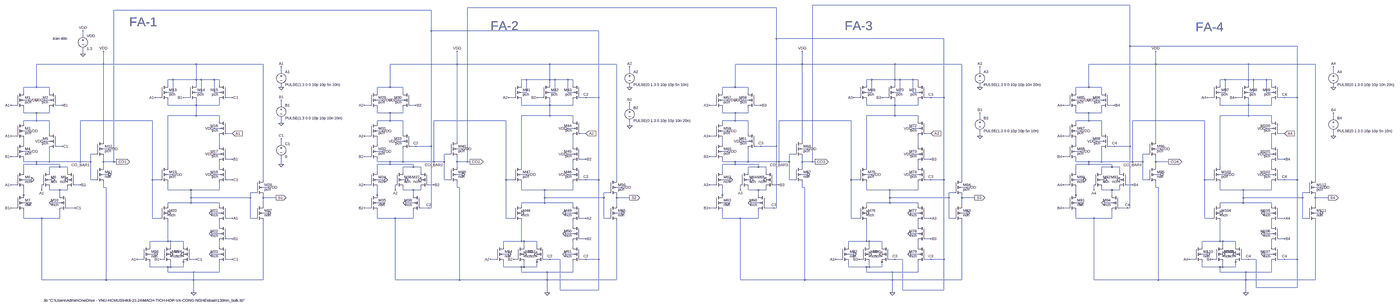
[diagram p0: schematic Full_adder_4bit.asc, whole sheet]
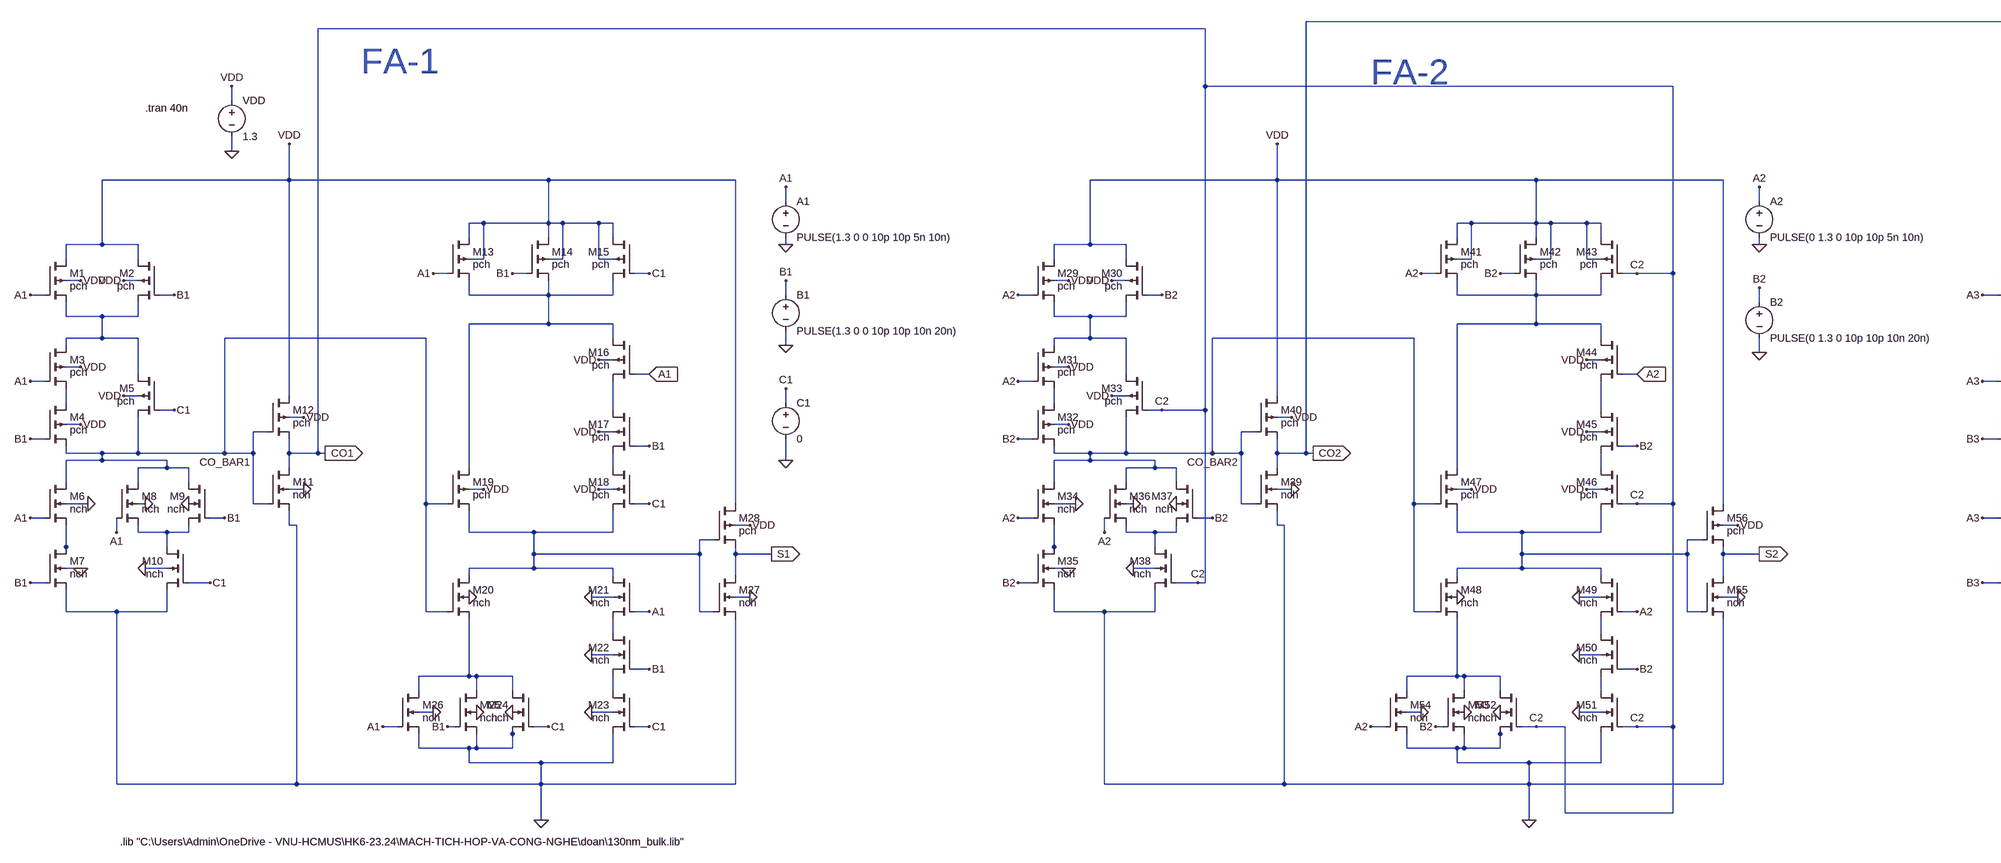
[diagram p1: schematic Full_adder_4bit.asc, part, row 1 of 1, column 1 of 2]
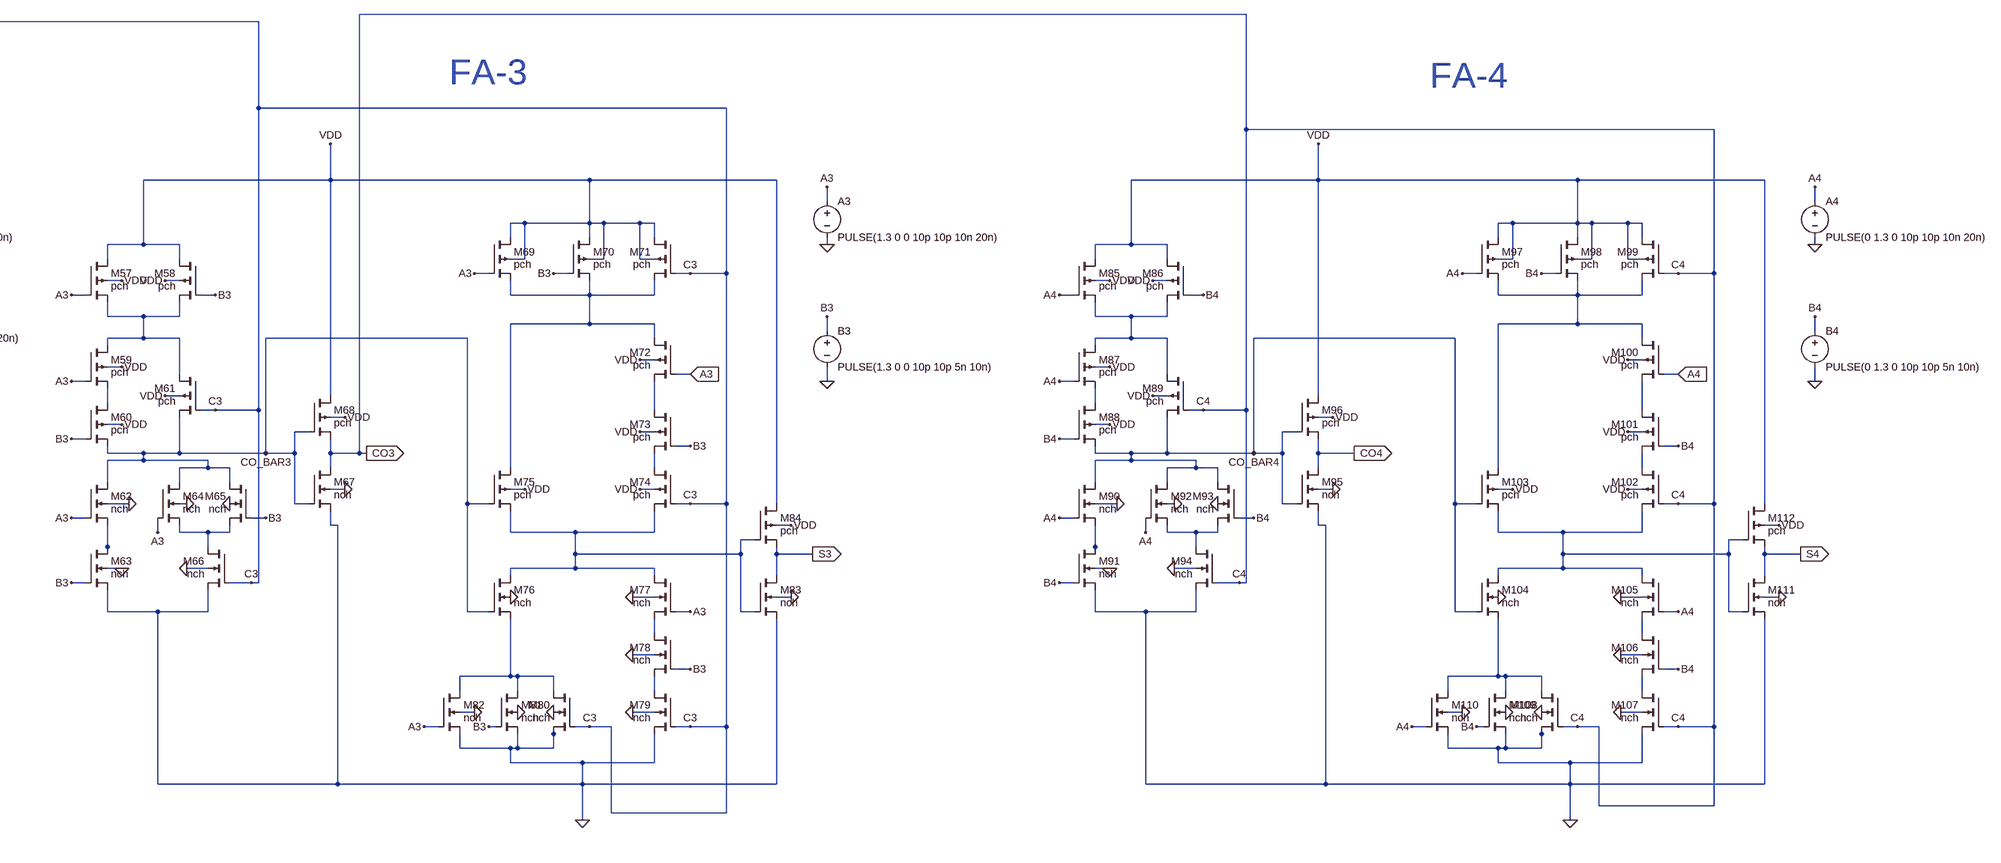
[diagram p2: schematic Full_adder_4bit.asc, part, row 1 of 1, column 2 of 2]
Full_adder_4bit.asc, the LTspice schematic file:
Version 4
SHEET 1 7908 1332
WIRE 6112 -928 4048 -928
WIRE 3824 -912 1904 -912
WIRE 1680 -896 -384 -896
WIRE 1680 -768 1680 -896
WIRE 2720 -768 1680 -768
WIRE -576 -736 -576 -768
WIRE 3824 -720 3824 -912
WIRE 4864 -720 3824 -720
WIRE 6112 -672 6112 -928
WIRE 7152 -672 6112 -672
WIRE -576 -624 -576 -656
WIRE -448 -560 -448 -640
WIRE -448 -560 -864 -560
WIRE 128 -560 -448 -560
WIRE 544 -560 128 -560
WIRE 1840 -560 1840 -640
WIRE 1840 -560 1424 -560
WIRE 2416 -560 1840 -560
WIRE 2832 -560 2416 -560
WIRE 3984 -560 3984 -640
WIRE 3984 -560 3568 -560
WIRE 4560 -560 3984 -560
WIRE 4976 -560 4560 -560
WIRE 6272 -560 6272 -640
WIRE 6272 -560 5856 -560
WIRE 6848 -560 6272 -560
WIRE 7264 -560 6848 -560
WIRE 656 -512 656 -544
WIRE 2912 -512 2912 -544
WIRE 5088 -512 5088 -544
WIRE 7376 -512 7376 -544
WIRE -16 -464 -48 -464
WIRE 128 -464 128 -560
WIRE 128 -464 -16 -464
WIRE 160 -464 128 -464
WIRE 240 -464 160 -464
WIRE 272 -464 240 -464
WIRE 2272 -464 2240 -464
WIRE 2416 -464 2416 -560
WIRE 2416 -464 2272 -464
WIRE 2448 -464 2416 -464
WIRE 2528 -464 2448 -464
WIRE 2560 -464 2528 -464
WIRE 4416 -464 4384 -464
WIRE 4560 -464 4560 -560
WIRE 4560 -464 4416 -464
WIRE 4592 -464 4560 -464
WIRE 4672 -464 4592 -464
WIRE 4704 -464 4672 -464
WIRE 6704 -464 6672 -464
WIRE 6848 -464 6848 -560
WIRE 6848 -464 6704 -464
WIRE 6880 -464 6848 -464
WIRE 6960 -464 6880 -464
WIRE 6992 -464 6960 -464
WIRE -48 -432 -48 -464
WIRE 128 -432 128 -464
WIRE 272 -432 272 -464
WIRE 2240 -432 2240 -464
WIRE 2416 -432 2416 -464
WIRE 2560 -432 2560 -464
WIRE 4384 -432 4384 -464
WIRE 4560 -432 4560 -464
WIRE 4704 -432 4704 -464
WIRE 6672 -432 6672 -464
WIRE 6848 -432 6848 -464
WIRE 6992 -432 6992 -464
WIRE -864 -416 -864 -560
WIRE -864 -416 -944 -416
WIRE -784 -416 -864 -416
WIRE 656 -416 656 -432
WIRE 1424 -416 1424 -560
WIRE 1424 -416 1344 -416
WIRE 1504 -416 1424 -416
WIRE 2912 -416 2912 -432
WIRE 3568 -416 3568 -560
WIRE 3568 -416 3488 -416
WIRE 3648 -416 3568 -416
WIRE 5088 -416 5088 -432
WIRE 5856 -416 5856 -560
WIRE 5856 -416 5776 -416
WIRE 5936 -416 5856 -416
WIRE 7376 -416 7376 -432
WIRE -944 -384 -944 -416
WIRE -784 -384 -784 -416
WIRE -16 -384 -16 -464
WIRE -16 -384 -48 -384
WIRE 160 -384 160 -464
WIRE 160 -384 128 -384
WIRE 240 -384 240 -464
WIRE 272 -384 240 -384
WIRE 1344 -384 1344 -416
WIRE 1504 -384 1504 -416
WIRE 2272 -384 2272 -464
WIRE 2272 -384 2240 -384
WIRE 2448 -384 2448 -464
WIRE 2448 -384 2416 -384
WIRE 2528 -384 2528 -464
WIRE 2560 -384 2528 -384
WIRE 3488 -384 3488 -416
WIRE 3648 -384 3648 -416
WIRE 4416 -384 4416 -464
WIRE 4416 -384 4384 -384
WIRE 4592 -384 4592 -464
WIRE 4592 -384 4560 -384
WIRE 4672 -384 4672 -464
WIRE 4704 -384 4672 -384
WIRE 5776 -384 5776 -416
WIRE 5936 -384 5936 -416
WIRE 6704 -384 6704 -464
WIRE 6704 -384 6672 -384
WIRE 6880 -384 6880 -464
WIRE 6880 -384 6848 -384
WIRE 6960 -384 6960 -464
WIRE 6992 -384 6960 -384
WIRE -96 -352 -128 -352
WIRE 80 -352 48 -352
WIRE 352 -352 320 -352
WIRE 2192 -352 2160 -352
WIRE 2368 -352 2336 -352
WIRE 2640 -352 2608 -352
WIRE 2720 -352 2720 -768
WIRE 2720 -352 2640 -352
WIRE 4336 -352 4304 -352
WIRE 4512 -352 4480 -352
WIRE 4784 -352 4752 -352
WIRE 4864 -352 4864 -720
WIRE 4864 -352 4784 -352
WIRE 6624 -352 6592 -352
WIRE 6800 -352 6768 -352
WIRE 7072 -352 7040 -352
WIRE 7152 -352 7152 -672
WIRE 7152 -352 7072 -352
WIRE -912 -336 -944 -336
WIRE -784 -336 -816 -336
WIRE 1376 -336 1344 -336
WIRE 1504 -336 1472 -336
WIRE 3520 -336 3488 -336
WIRE 3648 -336 3616 -336
WIRE 5808 -336 5776 -336
WIRE 5936 -336 5904 -336
WIRE -992 -304 -1024 -304
WIRE -704 -304 -736 -304
WIRE -48 -304 -48 -336
WIRE 128 -304 128 -336
WIRE 128 -304 -48 -304
WIRE 272 -304 272 -336
WIRE 272 -304 128 -304
WIRE 656 -304 656 -336
WIRE 1296 -304 1264 -304
WIRE 1584 -304 1552 -304
WIRE 2240 -304 2240 -336
WIRE 2416 -304 2416 -336
WIRE 2416 -304 2240 -304
WIRE 2560 -304 2560 -336
WIRE 2560 -304 2416 -304
WIRE 3440 -304 3408 -304
WIRE 3728 -304 3696 -304
WIRE 4384 -304 4384 -336
WIRE 4560 -304 4560 -336
WIRE 4560 -304 4384 -304
WIRE 4704 -304 4704 -336
WIRE 4704 -304 4560 -304
WIRE 5728 -304 5696 -304
WIRE 6016 -304 5984 -304
WIRE 6672 -304 6672 -336
WIRE 6848 -304 6848 -336
WIRE 6848 -304 6672 -304
WIRE 6992 -304 6992 -336
WIRE 6992 -304 6848 -304
WIRE 2912 -288 2912 -320
WIRE -944 -256 -944 -288
WIRE -864 -256 -944 -256
WIRE -784 -256 -784 -288
WIRE -784 -256 -864 -256
WIRE 1344 -256 1344 -288
WIRE 1424 -256 1344 -256
WIRE 1504 -256 1504 -288
WIRE 1504 -256 1424 -256
WIRE 3488 -256 3488 -288
WIRE 3568 -256 3488 -256
WIRE 3648 -256 3648 -288
WIRE 3648 -256 3568 -256
WIRE 5776 -256 5776 -288
WIRE 5856 -256 5776 -256
WIRE 5936 -256 5936 -288
WIRE 5936 -256 5856 -256
WIRE 128 -240 128 -304
WIRE 128 -240 -48 -240
WIRE 272 -240 128 -240
WIRE 2416 -240 2416 -304
WIRE 2416 -240 2240 -240
WIRE 2560 -240 2416 -240
WIRE 4560 -240 4560 -304
WIRE 4560 -240 4384 -240
WIRE 4704 -240 4560 -240
WIRE 6848 -240 6848 -304
WIRE 6848 -240 6672 -240
WIRE 6992 -240 6848 -240
WIRE 5088 -224 5088 -256
WIRE 7376 -224 7376 -256
WIRE -864 -208 -864 -256
WIRE -864 -208 -944 -208
WIRE -784 -208 -864 -208
WIRE -144 -208 -592 -208
WIRE 272 -208 272 -240
WIRE 1424 -208 1424 -256
WIRE 1424 -208 1344 -208
WIRE 1504 -208 1424 -208
WIRE 2144 -208 1696 -208
WIRE 2560 -208 2560 -240
WIRE 3568 -208 3568 -256
WIRE 3568 -208 3488 -208
WIRE 3648 -208 3568 -208
WIRE 4288 -208 3840 -208
WIRE 4704 -208 4704 -240
WIRE 5856 -208 5856 -256
WIRE 5856 -208 5776 -208
WIRE 5936 -208 5856 -208
WIRE 6576 -208 6128 -208
WIRE 6992 -208 6992 -240
WIRE -944 -192 -944 -208
WIRE 656 -192 656 -224
WIRE 1344 -192 1344 -208
WIRE 3488 -192 3488 -208
WIRE 5776 -192 5776 -208
WIRE 2912 -176 2912 -208
WIRE 272 -160 240 -160
WIRE 2560 -160 2528 -160
WIRE 4704 -160 4672 -160
WIRE 6992 -160 6960 -160
WIRE -912 -144 -944 -144
WIRE 1376 -144 1344 -144
WIRE 3520 -144 3488 -144
WIRE 5808 -144 5776 -144
WIRE -784 -128 -784 -208
WIRE 352 -128 320 -128
WIRE 1504 -128 1504 -208
WIRE 2640 -128 2608 -128
WIRE 3648 -128 3648 -208
WIRE 4784 -128 4752 -128
WIRE 5936 -128 5936 -208
WIRE 7072 -128 7040 -128
WIRE -992 -112 -1024 -112
WIRE 1296 -112 1264 -112
WIRE 3440 -112 3408 -112
WIRE 5088 -112 5088 -144
WIRE 5728 -112 5696 -112
WIRE 7376 -112 7376 -144
WIRE -784 -80 -816 -80
WIRE -448 -80 -448 -560
WIRE 1504 -80 1472 -80
WIRE 1840 -80 1840 -560
WIRE 3648 -80 3616 -80
WIRE 3984 -80 3984 -560
WIRE 5936 -80 5904 -80
WIRE 6272 -80 6272 -560
WIRE -944 -64 -944 -96
WIRE 656 -64 656 -96
WIRE 1344 -64 1344 -96
WIRE 3488 -64 3488 -96
WIRE 5776 -64 5776 -96
WIRE -704 -48 -736 -48
WIRE 272 -48 272 -112
WIRE 1584 -48 1552 -48
WIRE 1680 -48 1680 -768
WIRE 1680 -48 1584 -48
WIRE 2560 -48 2560 -112
WIRE 3728 -48 3696 -48
WIRE 3824 -48 3824 -720
WIRE 3824 -48 3728 -48
WIRE 4704 -48 4704 -112
WIRE 6016 -48 5984 -48
WIRE 6112 -48 6112 -672
WIRE 6112 -48 6016 -48
WIRE 6992 -48 6992 -112
WIRE -416 -32 -448 -32
WIRE 1872 -32 1840 -32
WIRE 4016 -32 3984 -32
WIRE 6304 -32 6272 -32
WIRE -912 -16 -944 -16
WIRE 1376 -16 1344 -16
WIRE 3520 -16 3488 -16
WIRE 5808 -16 5776 -16
WIRE -496 0 -528 0
WIRE 272 0 240 0
WIRE 1792 0 1760 0
WIRE 2560 0 2528 0
WIRE 3936 0 3904 0
WIRE 4704 0 4672 0
WIRE 6224 0 6192 0
WIRE 6992 0 6960 0
WIRE -992 16 -1024 16
WIRE 1296 16 1264 16
WIRE 3440 16 3408 16
WIRE 5728 16 5696 16
WIRE 352 32 320 32
WIRE 2640 32 2608 32
WIRE 4784 32 4752 32
WIRE 7072 32 7040 32
WIRE -944 48 -944 32
WIRE -864 48 -944 48
WIRE -784 48 -784 -32
WIRE -784 48 -864 48
WIRE -592 48 -592 -208
WIRE -592 48 -784 48
WIRE -528 48 -528 0
WIRE -528 48 -592 48
WIRE -448 48 -448 16
WIRE -384 48 -384 -896
WIRE -384 48 -448 48
WIRE -368 48 -384 48
WIRE 1344 48 1344 32
WIRE 1424 48 1344 48
WIRE 1504 48 1504 -32
WIRE 1504 48 1424 48
WIRE 1696 48 1696 -208
WIRE 1696 48 1504 48
WIRE 1760 48 1760 0
WIRE 1760 48 1696 48
WIRE 1840 48 1840 16
WIRE 1904 48 1904 -912
WIRE 1904 48 1840 48
WIRE 1920 48 1904 48
WIRE 3488 48 3488 32
WIRE 3568 48 3488 48
WIRE 3648 48 3648 -32
WIRE 3648 48 3568 48
WIRE 3840 48 3840 -208
WIRE 3840 48 3648 48
WIRE 3904 48 3904 0
WIRE 3904 48 3840 48
WIRE 3984 48 3984 16
WIRE 4048 48 4048 -928
WIRE 4048 48 3984 48
WIRE 4064 48 4048 48
WIRE 5776 48 5776 32
WIRE 5856 48 5776 48
WIRE 5936 48 5936 -32
WIRE 5936 48 5856 48
WIRE 6128 48 6128 -208
WIRE 6128 48 5936 48
WIRE 6192 48 6192 0
WIRE 6192 48 6128 48
WIRE 6272 48 6272 16
WIRE 6352 48 6272 48
WIRE -864 64 -864 48
WIRE -864 64 -944 64
WIRE -720 64 -864 64
WIRE 656 64 656 16
WIRE 1424 64 1424 48
WIRE 1424 64 1344 64
WIRE 1568 64 1424 64
WIRE 3568 64 3568 48
WIRE 3568 64 3488 64
WIRE 3712 64 3568 64
WIRE 5856 64 5856 48
WIRE 5856 64 5776 64
WIRE 6000 64 5856 64
WIRE -720 80 -720 64
WIRE -720 80 -784 80
WIRE -672 80 -720 80
WIRE -448 80 -448 48
WIRE -48 80 -48 -240
WIRE 272 80 272 48
WIRE 1568 80 1568 64
WIRE 1568 80 1504 80
WIRE 1616 80 1568 80
WIRE 1840 80 1840 48
WIRE 2240 80 2240 -240
WIRE 2560 80 2560 48
WIRE 3712 80 3712 64
WIRE 3712 80 3648 80
WIRE 3760 80 3712 80
WIRE 3984 80 3984 48
WIRE 4384 80 4384 -240
WIRE 4704 80 4704 48
WIRE 6000 80 6000 64
WIRE 6000 80 5936 80
WIRE 6048 80 6000 80
WIRE 6272 80 6272 48
WIRE 6672 80 6672 -240
WIRE 6992 80 6992 48
WIRE -944 112 -944 64
WIRE -784 112 -784 80
WIRE -672 112 -672 80
WIRE 1344 112 1344 64
WIRE 1504 112 1504 80
WIRE 1616 112 1616 80
WIRE 3488 112 3488 64
WIRE 3648 112 3648 80
WIRE 3760 112 3760 80
WIRE 5776 112 5776 64
WIRE 5936 112 5936 80
WIRE 6048 112 6048 80
WIRE -416 128 -448 128
WIRE -16 128 -48 128
WIRE 272 128 240 128
WIRE 1872 128 1840 128
WIRE 2272 128 2240 128
WIRE 2560 128 2528 128
WIRE 4016 128 3984 128
WIRE 4416 128 4384 128
WIRE 4704 128 4672 128
WIRE 6304 128 6272 128
WIRE 6704 128 6672 128
WIRE 6992 128 6960 128
WIRE -896 160 -944 160
WIRE -768 160 -784 160
WIRE -528 160 -528 48
WIRE -496 160 -528 160
WIRE -144 160 -144 -208
WIRE -96 160 -144 160
WIRE 352 160 320 160
WIRE 544 160 544 -560
WIRE 1392 160 1344 160
WIRE 1520 160 1504 160
WIRE 1760 160 1760 48
WIRE 1792 160 1760 160
WIRE 2144 160 2144 -208
WIRE 2192 160 2144 160
WIRE 2640 160 2608 160
WIRE 2720 160 2720 -352
WIRE 2720 160 2640 160
WIRE 2832 160 2832 -560
WIRE 3536 160 3488 160
WIRE 3664 160 3648 160
WIRE 3904 160 3904 48
WIRE 3936 160 3904 160
WIRE 4288 160 4288 -208
WIRE 4336 160 4288 160
WIRE 4784 160 4752 160
WIRE 4864 160 4864 -352
WIRE 4864 160 4784 160
WIRE 4976 160 4976 -560
WIRE 5824 160 5776 160
WIRE 5952 160 5936 160
WIRE 6192 160 6192 48
WIRE 6224 160 6192 160
WIRE 6576 160 6576 -208
WIRE 6624 160 6576 160
WIRE 7072 160 7040 160
WIRE 7152 160 7152 -352
WIRE 7152 160 7072 160
WIRE 7264 160 7264 -560
WIRE -992 192 -1024 192
WIRE -592 192 -624 192
WIRE 1296 192 1264 192
WIRE 1696 192 1664 192
WIRE 3440 192 3408 192
WIRE 3840 192 3808 192
WIRE 5728 192 5696 192
WIRE 6128 192 6096 192
WIRE -448 208 -448 176
WIRE -432 208 -448 208
WIRE 576 208 544 208
WIRE 1840 208 1840 176
WIRE 1856 208 1840 208
WIRE 2864 208 2832 208
WIRE 3984 208 3984 176
WIRE 4000 208 3984 208
WIRE 5008 208 4976 208
WIRE 6272 208 6272 176
WIRE 6288 208 6272 208
WIRE 7296 208 7264 208
WIRE -832 224 -832 192
WIRE -784 224 -784 208
WIRE -720 224 -784 224
WIRE -672 224 -672 208
WIRE -672 224 -720 224
WIRE -48 224 -48 176
WIRE 96 224 -48 224
WIRE 272 224 272 176
WIRE 272 224 96 224
WIRE 1456 224 1456 192
WIRE 1504 224 1504 208
WIRE 1568 224 1504 224
WIRE 1616 224 1616 208
WIRE 1616 224 1568 224
WIRE 2240 224 2240 176
WIRE 2384 224 2240 224
WIRE 2560 224 2560 176
WIRE 2560 224 2384 224
WIRE 3600 224 3600 192
WIRE 3648 224 3648 208
WIRE 3712 224 3648 224
WIRE 3760 224 3760 208
WIRE 3760 224 3712 224
WIRE 4384 224 4384 176
WIRE 4528 224 4384 224
WIRE 4704 224 4704 176
WIRE 4704 224 4528 224
WIRE 5888 224 5888 192
WIRE 5936 224 5936 208
WIRE 6000 224 5936 224
WIRE 6048 224 6048 208
WIRE 6048 224 6000 224
WIRE 6672 224 6672 176
WIRE 6816 224 6672 224
WIRE 6992 224 6992 176
WIRE 6992 224 6816 224
WIRE 496 240 464 240
WIRE 2784 240 2752 240
WIRE 4928 240 4896 240
WIRE 7216 240 7184 240
WIRE -944 256 -944 208
WIRE -720 256 -720 224
WIRE 1344 256 1344 208
WIRE 1568 256 1568 224
WIRE 3488 256 3488 208
WIRE 3712 256 3712 224
WIRE 5776 256 5776 208
WIRE 6000 256 6000 224
WIRE -944 272 -944 256
WIRE 96 272 96 224
WIRE 464 272 464 240
WIRE 464 272 96 272
WIRE 544 272 544 256
WIRE 624 272 544 272
WIRE 1344 272 1344 256
WIRE 2384 272 2384 224
WIRE 2752 272 2752 240
WIRE 2752 272 2384 272
WIRE 2832 272 2832 256
WIRE 2912 272 2832 272
WIRE 3488 272 3488 256
WIRE 4528 272 4528 224
WIRE 4896 272 4896 240
WIRE 4896 272 4528 272
WIRE 4976 272 4976 256
WIRE 5056 272 4976 272
WIRE 5776 272 5776 256
WIRE 6816 272 6816 224
WIRE 7184 272 7184 240
WIRE 7184 272 6816 272
WIRE 7264 272 7264 256
WIRE 7344 272 7264 272
WIRE -912 304 -944 304
WIRE -896 304 -912 304
WIRE -720 304 -768 304
WIRE 96 304 96 272
WIRE 96 304 -48 304
WIRE 272 304 96 304
WIRE 1376 304 1344 304
WIRE 1392 304 1376 304
WIRE 1568 304 1520 304
WIRE 2384 304 2384 272
WIRE 2384 304 2240 304
WIRE 2560 304 2384 304
WIRE 3520 304 3488 304
WIRE 3536 304 3520 304
WIRE 3712 304 3664 304
WIRE 4528 304 4528 272
WIRE 4528 304 4384 304
WIRE 4704 304 4528 304
WIRE 5808 304 5776 304
WIRE 5824 304 5808 304
WIRE 6000 304 5952 304
WIRE 6816 304 6816 272
WIRE 6816 304 6672 304
WIRE 6992 304 6816 304
WIRE -48 320 -48 304
WIRE 272 320 272 304
WIRE 544 320 544 272
WIRE 2240 320 2240 304
WIRE 2560 320 2560 304
WIRE 2832 320 2832 272
WIRE 4384 320 4384 304
WIRE 4704 320 4704 304
WIRE 4976 320 4976 272
WIRE 6672 320 6672 304
WIRE 6992 320 6992 304
WIRE 7264 320 7264 272
WIRE -992 336 -1024 336
WIRE -624 336 -672 336
WIRE 1296 336 1264 336
WIRE 1664 336 1616 336
WIRE 1680 336 1680 -48
WIRE 1680 336 1664 336
WIRE 3440 336 3408 336
WIRE 3808 336 3760 336
WIRE 3824 336 3824 -48
WIRE 3824 336 3808 336
WIRE 5728 336 5696 336
WIRE 6096 336 6048 336
WIRE 6112 336 6112 -48
WIRE 6112 336 6096 336
WIRE 272 368 224 368
WIRE 576 368 544 368
WIRE 2560 368 2512 368
WIRE 2864 368 2832 368
WIRE 4704 368 4656 368
WIRE 5008 368 4976 368
WIRE 6992 368 6944 368
WIRE 7296 368 7264 368
WIRE -944 400 -944 352
WIRE -832 400 -944 400
WIRE -720 400 -720 352
WIRE -720 400 -832 400
WIRE -144 400 -144 160
WIRE -96 400 -144 400
WIRE 352 400 320 400
WIRE 464 400 464 272
WIRE 496 400 464 400
WIRE 1344 400 1344 352
WIRE 1456 400 1344 400
WIRE 1568 400 1568 352
WIRE 1568 400 1456 400
WIRE 2144 400 2144 160
WIRE 2192 400 2144 400
WIRE 2640 400 2608 400
WIRE 2752 400 2752 272
WIRE 2784 400 2752 400
WIRE 3488 400 3488 352
WIRE 3600 400 3488 400
WIRE 3712 400 3712 352
WIRE 3712 400 3600 400
WIRE 4288 400 4288 160
WIRE 4336 400 4288 400
WIRE 4784 400 4752 400
WIRE 4896 400 4896 272
WIRE 4928 400 4896 400
WIRE 5776 400 5776 352
WIRE 5888 400 5776 400
WIRE 6000 400 6000 352
WIRE 6000 400 5888 400
WIRE 6576 400 6576 160
WIRE 6624 400 6576 400
WIRE 7072 400 7040 400
WIRE 7184 400 7184 272
WIRE 7216 400 7184 400
WIRE 272 448 272 416
WIRE 2560 448 2560 416
WIRE 4704 448 4704 416
WIRE 6992 448 6992 416
WIRE 272 496 224 496
WIRE 2560 496 2512 496
WIRE 4704 496 4656 496
WIRE 6992 496 6944 496
WIRE 352 528 320 528
WIRE 2640 528 2608 528
WIRE 4784 528 4752 528
WIRE 7072 528 7040 528
WIRE -48 544 -48 416
WIRE -48 544 -160 544
WIRE -32 544 -48 544
WIRE 48 544 -32 544
WIRE 2240 544 2240 416
WIRE 2240 544 2128 544
WIRE 2256 544 2240 544
WIRE 2336 544 2256 544
WIRE 4384 544 4384 416
WIRE 4384 544 4272 544
WIRE 4400 544 4384 544
WIRE 4480 544 4400 544
WIRE 6672 544 6672 416
WIRE 6672 544 6560 544
WIRE 6688 544 6672 544
WIRE 6768 544 6688 544
WIRE -160 576 -160 544
WIRE -32 576 -32 544
WIRE 48 576 48 544
WIRE 272 576 272 544
WIRE 2128 576 2128 544
WIRE 2256 576 2256 544
WIRE 2336 576 2336 544
WIRE 2560 576 2560 544
WIRE 4272 576 4272 544
WIRE 4400 576 4400 544
WIRE 4480 576 4480 544
WIRE 4704 576 4704 544
WIRE 6560 576 6560 544
WIRE 6688 576 6688 544
WIRE 6768 576 6768 544
WIRE 6992 576 6992 544
WIRE -128 624 -160 624
WIRE 272 624 224 624
WIRE 2160 624 2128 624
WIRE 2560 624 2512 624
WIRE 4304 624 4272 624
WIRE 4704 624 4656 624
WIRE 6592 624 6560 624
WIRE 6992 624 6944 624
WIRE -208 656 -240 656
WIRE -80 656 -96 656
WIRE 128 656 96 656
WIRE 352 656 320 656
WIRE 2080 656 2048 656
WIRE 2208 656 2192 656
WIRE 2416 656 2384 656
WIRE 2480 656 2416 656
WIRE 2640 656 2608 656
WIRE 2720 656 2720 160
WIRE 2720 656 2640 656
WIRE 4224 656 4192 656
WIRE 4352 656 4336 656
WIRE 4560 656 4528 656
WIRE 4608 656 4560 656
WIRE 4784 656 4752 656
WIRE 4864 656 4864 160
WIRE 4864 656 4784 656
WIRE 6512 656 6480 656
WIRE 6640 656 6624 656
WIRE 6848 656 6816 656
WIRE 6896 656 6848 656
WIRE 7072 656 7040 656
WIRE 7152 656 7152 160
WIRE 7152 656 7072 656
WIRE 48 672 48 656
WIRE 2336 672 2336 656
WIRE 4480 672 4480 656
WIRE 6768 672 6768 656
WIRE -160 704 -160 672
WIRE -48 704 -160 704
WIRE -32 704 -32 672
WIRE -32 704 -48 704
WIRE 48 704 48 672
WIRE 48 704 -32 704
WIRE 2128 704 2128 672
WIRE 2240 704 2128 704
WIRE 2256 704 2256 672
WIRE 2256 704 2240 704
WIRE 2336 704 2336 672
WIRE 2336 704 2256 704
WIRE 4272 704 4272 672
WIRE 4384 704 4272 704
WIRE 4400 704 4400 672
WIRE 4400 704 4384 704
WIRE 4480 704 4480 672
WIRE 4480 704 4400 704
WIRE 6560 704 6560 672
WIRE 6672 704 6560 704
WIRE 6688 704 6688 672
WIRE 6688 704 6672 704
WIRE 6768 704 6768 672
WIRE 6768 704 6688 704
WIRE -48 736 -48 704
WIRE 112 736 -48 736
WIRE 272 736 272 672
WIRE 272 736 112 736
WIRE 2240 736 2240 704
WIRE 2400 736 2240 736
WIRE 2560 736 2560 672
WIRE 2560 736 2400 736
WIRE 4384 736 4384 704
WIRE 4544 736 4384 736
WIRE 4704 736 4704 672
WIRE 4704 736 4544 736
WIRE 6672 736 6672 704
WIRE 6832 736 6672 736
WIRE 6992 736 6992 672
WIRE 6992 736 6832 736
WIRE -832 784 -832 400
WIRE -432 784 -432 208
WIRE -432 784 -832 784
WIRE 112 784 112 736
WIRE 112 784 -432 784
WIRE 544 784 544 416
WIRE 544 784 112 784
WIRE 1456 784 1456 400
WIRE 1856 784 1856 208
WIRE 1856 784 1456 784
WIRE 2400 784 2400 736
WIRE 2400 784 1856 784
WIRE 2832 784 2832 416
WIRE 2832 784 2400 784
WIRE 3600 784 3600 400
WIRE 4000 784 4000 208
WIRE 4000 784 3600 784
WIRE 4544 784 4544 736
WIRE 4544 784 4000 784
WIRE 4976 784 4976 416
WIRE 4976 784 4544 784
WIRE 5888 784 5888 400
WIRE 6288 784 6288 208
WIRE 6288 784 5888 784
WIRE 6832 784 6832 736
WIRE 6832 784 6288 784
WIRE 7264 784 7264 416
WIRE 7264 784 6832 784
WIRE 6896 832 6896 656
WIRE 7152 832 7152 656
WIRE 7152 832 6896 832
WIRE 2480 848 2480 656
WIRE 2720 848 2720 656
WIRE 2720 848 2480 848
WIRE 4608 848 4608 656
WIRE 4864 848 4864 656
WIRE 4864 848 4608 848
WIRE 112 864 112 784
WIRE 2400 864 2400 784
WIRE 4544 864 4544 784
WIRE 6832 864 6832 784
FLAG -1024 -304 A1
FLAG -704 -304 B1
FLAG -1024 -112 A1
FLAG -704 -48 C1
FLAG -1024 16 B1
FLAG -592 48 CO_BAR1
FLAG -1024 192 A1
FLAG -832 224 A1
FLAG -592 192 B1
FLAG -1024 336 B1
FLAG -624 336 C1
FLAG -368 48 CO1
IOPIN -368 48 Out
FLAG 112 864 0
FLAG -128 -352 A1
FLAG 48 -352 B1
FLAG 352 -352 C1
FLAG 352 -128 A1
IOPIN 352 -128 In
FLAG 352 32 B1
FLAG 352 160 C1
FLAG 352 400 A1
FLAG 352 528 B1
FLAG 352 656 C1
FLAG 128 656 C1
FLAG -96 656 B1
FLAG -240 656 A1
FLAG 624 272 S1
IOPIN 624 272 Out
FLAG -448 -640 VDD
FLAG 656 64 0
FLAG 656 -192 0
FLAG 656 -416 0
FLAG -576 -624 0
FLAG -576 -768 VDD
FLAG 656 -544 A1
FLAG 656 -336 B1
FLAG 656 -96 C1
FLAG -912 -336 VDD
FLAG -816 -336 VDD
FLAG -912 -144 VDD
FLAG -816 -80 VDD
FLAG -912 -16 VDD
FLAG -416 -32 VDD
FLAG 240 -160 VDD
FLAG 240 0 VDD
FLAG 240 128 VDD
FLAG -16 128 VDD
FLAG -416 128 0
FLAG -768 160 0
FLAG -672 160 0
FLAG -896 160 0
FLAG -912 304 0
FLAG -768 304 0
FLAG -48 368 0
FLAG 224 368 0
FLAG 224 496 0
FLAG -128 624 0
FLAG -32 624 0
FLAG 48 624 0
FLAG 224 624 0
FLAG 576 368 0
FLAG 576 208 VDD
FLAG 1264 -304 A2
FLAG 1584 -304 B2
FLAG 1264 -112 A2
FLAG 1584 -48 C2
FLAG 1264 16 B2
FLAG 1696 48 CO_BAR2
FLAG 1264 192 A2
FLAG 1456 224 A2
FLAG 1696 192 B2
FLAG 1264 336 B2
FLAG 1664 336 C2
FLAG 1920 48 CO2
IOPIN 1920 48 Out
FLAG 2400 864 0
FLAG 2160 -352 A2
FLAG 2336 -352 B2
FLAG 2640 -352 C2
FLAG 2640 -128 A2
IOPIN 2640 -128 In
FLAG 2640 32 B2
FLAG 2640 160 C2
FLAG 2640 400 A2
FLAG 2640 528 B2
FLAG 2640 656 C2
FLAG 2416 656 C2
FLAG 2192 656 B2
FLAG 2048 656 A2
FLAG 2912 272 S2
IOPIN 2912 272 Out
FLAG 1840 -640 VDD
FLAG 2912 -176 0
FLAG 2912 -416 0
FLAG 2912 -544 A2
FLAG 2912 -320 B2
FLAG 1376 -336 VDD
FLAG 1472 -336 VDD
FLAG 1376 -144 VDD
FLAG 1472 -80 VDD
FLAG 1376 -16 VDD
FLAG 1872 -32 VDD
FLAG 2528 -160 VDD
FLAG 2528 0 VDD
FLAG 2528 128 VDD
FLAG 2272 128 VDD
FLAG 1872 128 0
FLAG 1520 160 0
FLAG 1616 160 0
FLAG 1392 160 0
FLAG 1376 304 0
FLAG 1520 304 0
FLAG 2240 368 0
FLAG 2512 368 0
FLAG 2512 496 0
FLAG 2160 624 0
FLAG 2256 624 0
FLAG 2336 624 0
FLAG 2512 624 0
FLAG 2864 368 0
FLAG 2864 208 VDD
FLAG 3408 -304 A3
FLAG 3728 -304 B3
FLAG 3408 -112 A3
FLAG 3728 -48 C3
FLAG 3408 16 B3
FLAG 3840 48 CO_BAR3
FLAG 3408 192 A3
FLAG 3600 224 A3
FLAG 3840 192 B3
FLAG 3408 336 B3
FLAG 3808 336 C3
FLAG 4064 48 CO3
IOPIN 4064 48 Out
FLAG 4544 864 0
FLAG 4304 -352 A3
FLAG 4480 -352 B3
FLAG 4784 -352 C3
FLAG 4784 -128 A3
IOPIN 4784 -128 In
FLAG 4784 32 B3
FLAG 4784 160 C3
FLAG 4784 400 A3
FLAG 4784 528 B3
FLAG 4784 656 C3
FLAG 4560 656 C3
FLAG 4336 656 B3
FLAG 4192 656 A3
FLAG 5056 272 S3
IOPIN 5056 272 Out
FLAG 3984 -640 VDD
FLAG 5088 -112 0
FLAG 5088 -416 0
FLAG 5088 -544 A3
FLAG 5088 -256 B3
FLAG 3520 -336 VDD
FLAG 3616 -336 VDD
FLAG 3520 -144 VDD
FLAG 3616 -80 VDD
FLAG 3520 -16 VDD
FLAG 4016 -32 VDD
FLAG 4672 -160 VDD
FLAG 4672 0 VDD
FLAG 4672 128 VDD
FLAG 4416 128 VDD
FLAG 4016 128 0
FLAG 3664 160 0
FLAG 3760 160 0
FLAG 3536 160 0
FLAG 3520 304 0
FLAG 3664 304 0
FLAG 4384 368 0
FLAG 4656 368 0
FLAG 4656 496 0
FLAG 4304 624 0
FLAG 4400 624 0
FLAG 4480 624 0
FLAG 4656 624 0
FLAG 5008 368 0
FLAG 5008 208 VDD
FLAG 5696 -304 A4
FLAG 6016 -304 B4
FLAG 5696 -112 A4
FLAG 6016 -48 C4
FLAG 5696 16 B4
FLAG 6128 48 CO_BAR4
FLAG 5696 192 A4
FLAG 5888 224 A4
FLAG 6128 192 B4
FLAG 5696 336 B4
FLAG 6096 336 C4
FLAG 6352 48 CO4
IOPIN 6352 48 Out
FLAG 6832 864 0
FLAG 6592 -352 A4
FLAG 6768 -352 B4
FLAG 7072 -352 C4
FLAG 7072 -128 A4
IOPIN 7072 -128 In
FLAG 7072 32 B4
FLAG 7072 160 C4
FLAG 7072 400 A4
FLAG 7072 528 B4
FLAG 7072 656 C4
FLAG 6848 656 C4
FLAG 6624 656 B4
FLAG 6480 656 A4
FLAG 7344 272 S4
IOPIN 7344 272 Out
FLAG 6272 -640 VDD
FLAG 7376 -112 0
FLAG 7376 -416 0
FLAG 7376 -544 A4
FLAG 7376 -256 B4
FLAG 5808 -336 VDD
FLAG 5904 -336 VDD
FLAG 5808 -144 VDD
FLAG 5904 -80 VDD
FLAG 5808 -16 VDD
FLAG 6304 -32 VDD
FLAG 6960 -160 VDD
FLAG 6960 0 VDD
FLAG 6960 128 VDD
FLAG 6704 128 VDD
FLAG 6304 128 0
FLAG 5952 160 0
FLAG 6048 160 0
FLAG 5824 160 0
FLAG 5808 304 0
FLAG 5952 304 0
FLAG 6672 368 0
FLAG 6944 368 0
FLAG 6944 496 0
FLAG 6592 624 0
FLAG 6688 624 0
FLAG 6768 624 0
FLAG 6944 624 0
FLAG 7296 368 0
FLAG 7296 208 VDD
SYMBOL pmos4 -992 -384 R0
WINDOW 3 56 60 Left 2
SYMATTR Value pch
SYMATTR InstName M1
SYMATTR Value2 l=130n w=0.78u
SYMBOL pmos4 -736 -384 M0
WINDOW 3 56 60 Left 2
SYMATTR Value pch
SYMATTR InstName M2
SYMATTR Value2 l=130n w=0.78u
SYMBOL pmos4 -992 -192 R0
WINDOW 3 56 60 Left 2
SYMATTR Value pch
SYMATTR InstName M3
SYMATTR Value2 l=130n w=0.78u
SYMBOL pmos4 -992 -64 R0
WINDOW 3 56 60 Left 2
SYMATTR Value pch
SYMATTR InstName M4
SYMATTR Value2 l=130n w=0.78u
SYMBOL pmos4 -736 -128 M0
WINDOW 3 56 60 Left 2
SYMATTR Value pch
SYMATTR InstName M5
SYMATTR Value2 l=130n w=0.39u
SYMBOL nmos4 -992 112 R0
WINDOW 3 56 60 Left 2
SYMATTR Value nch
SYMATTR InstName M6
SYMATTR Value2 l=130n w=0.26u
SYMBOL nmos4 -992 256 R0
WINDOW 3 56 60 Left 2
SYMATTR Value nch
SYMATTR InstName M7
SYMATTR Value2 l=130n w=0.26u
SYMBOL nmos4 -832 112 R0
WINDOW 3 56 60 Left 2
SYMATTR Value nch
SYMATTR InstName M8
SYMATTR Value2 l=130n w=0.26u
SYMBOL nmos4 -624 112 M0
WINDOW 3 56 60 Left 2
SYMATTR Value nch
SYMATTR InstName M9
SYMATTR Value2 l=130n w=0.26u
SYMBOL nmos4 -672 256 M0
WINDOW 3 56 60 Left 2
SYMATTR Value nch
SYMATTR InstName M10
SYMATTR Value2 l=130n w=0.26u
SYMBOL nmos4 -496 80 R0
WINDOW 3 56 60 Left 2
SYMATTR Value nch
SYMATTR InstName M11
SYMATTR Value2 l=130n w=130n
SYMBOL pmos4 -496 -80 R0
WINDOW 3 56 60 Left 2
SYMATTR Value pch
SYMATTR InstName M12
SYMATTR Value2 l=130n w=0.26u
SYMBOL pmos4 -96 -432 R0
WINDOW 3 56 60 Left 2
SYMATTR Value pch
SYMATTR InstName M13
SYMATTR Value2 l=130n w=1.08u
SYMBOL pmos4 80 -432 R0
WINDOW 3 56 60 Left 2
SYMATTR Value pch
SYMATTR InstName M14
SYMATTR Value2 l=130n w=1.08u
SYMBOL pmos4 320 -432 M0
WINDOW 3 56 60 Left 2
SYMATTR Value pch
SYMATTR InstName M15
SYMATTR Value2 l=130n w=1.08u
SYMBOL pmos4 320 -208 M0
WINDOW 3 56 60 Left 2
SYMATTR Value pch
SYMATTR InstName M16
SYMATTR Value2 l=130n w=1.08u
SYMBOL pmos4 320 -48 M0
WINDOW 3 56 60 Left 2
SYMATTR Value pch
SYMATTR InstName M17
SYMATTR Value2 l=130n w=1.08u
SYMBOL pmos4 320 80 M0
WINDOW 3 56 60 Left 2
SYMATTR Value pch
SYMATTR InstName M18
SYMATTR Value2 l=130n w=1.08u
SYMBOL pmos4 -96 80 R0
WINDOW 3 56 60 Left 2
SYMATTR Value pch
SYMATTR InstName M19
SYMATTR Value2 l=130n w=0.52u
SYMBOL nmos4 -96 320 R0
WINDOW 3 56 60 Left 2
SYMATTR Value nch
SYMATTR InstName M20
SYMATTR Value2 l=130n w=0.26u
SYMBOL nmos4 320 320 M0
WINDOW 3 56 60 Left 2
SYMATTR Value nch
SYMATTR InstName M21
SYMATTR Value2 l=130n w=0.39u
SYMBOL nmos4 320 448 M0
WINDOW 3 56 60 Left 2
SYMATTR Value nch
SYMATTR InstName M22
SYMATTR Value2 l=130n w=0.39u
SYMBOL nmos4 320 576 M0
WINDOW 3 56 60 Left 2
SYMATTR Value nch
SYMATTR InstName M23
SYMATTR Value2 l=130n w=0.39u
SYMBOL nmos4 96 576 M0
WINDOW 3 56 60 Left 2
SYMATTR Value nch
SYMATTR InstName M24
SYMATTR Value2 l=130n w=0.26u
SYMBOL nmos4 -80 576 R0
WINDOW 3 56 60 Left 2
SYMATTR Value nch
SYMATTR InstName M25
SYMATTR Value2 l=130n w=0.26u
SYMBOL nmos4 -208 576 R0
WINDOW 3 56 60 Left 2
SYMATTR Value nch
SYMATTR InstName M26
SYMATTR Value2 l=130n w=0.26u
SYMBOL nmos4 496 320 R0
WINDOW 3 56 60 Left 2
SYMATTR Value nch
SYMATTR InstName M27
SYMATTR Value2 l=130n w=130n
SYMBOL pmos4 496 160 R0
WINDOW 3 56 60 Left 2
SYMATTR Value pch
SYMATTR InstName M28
SYMATTR Value2 l=130n w=0.26u
SYMBOL voltage 656 -528 R0
WINDOW 123 0 0 Left 0
WINDOW 39 0 0 Left 0
SYMATTR InstName A1
SYMATTR Value PULSE(1.3 0 0 10p 10p 5n 10n)
SYMBOL voltage 656 -320 R0
WINDOW 123 0 0 Left 0
WINDOW 39 0 0 Left 0
SYMATTR InstName B1
SYMATTR Value PULSE(1.3 0 0 10p 10p 10n 20n)
SYMBOL voltage 656 -80 R0
WINDOW 123 0 0 Left 0
WINDOW 39 0 0 Left 0
SYMATTR InstName C1
SYMATTR Value 0
SYMBOL voltage -576 -752 R0
WINDOW 123 0 0 Left 0
WINDOW 39 0 0 Left 0
SYMATTR InstName VDD
SYMATTR Value 1.3
SYMBOL pmos4 1296 -384 R0
WINDOW 3 56 60 Left 2
SYMATTR Value pch
SYMATTR InstName M29
SYMATTR Value2 l=130n w=0.78u
SYMBOL pmos4 1552 -384 M0
WINDOW 3 56 60 Left 2
SYMATTR Value pch
SYMATTR InstName M30
SYMATTR Value2 l=130n w=0.78u
SYMBOL pmos4 1296 -192 R0
WINDOW 3 56 60 Left 2
SYMATTR Value pch
SYMATTR InstName M31
SYMATTR Value2 l=130n w=0.78u
SYMBOL pmos4 1296 -64 R0
WINDOW 3 56 60 Left 2
SYMATTR Value pch
SYMATTR InstName M32
SYMATTR Value2 l=130n w=0.78u
SYMBOL pmos4 1552 -128 M0
WINDOW 3 56 60 Left 2
SYMATTR Value pch
SYMATTR InstName M33
SYMATTR Value2 l=130n w=0.39u
SYMBOL nmos4 1296 112 R0
WINDOW 3 56 60 Left 2
SYMATTR Value nch
SYMATTR InstName M34
SYMATTR Value2 l=130n w=0.26u
SYMBOL nmos4 1296 256 R0
WINDOW 3 56 60 Left 2
SYMATTR Value nch
SYMATTR InstName M35
SYMATTR Value2 l=130n w=0.26u
SYMBOL nmos4 1456 112 R0
WINDOW 3 56 60 Left 2
SYMATTR Value nch
SYMATTR InstName M36
SYMATTR Value2 l=130n w=0.26u
SYMBOL nmos4 1664 112 M0
WINDOW 3 56 60 Left 2
SYMATTR Value nch
SYMATTR InstName M37
SYMATTR Value2 l=130n w=0.26u
SYMBOL nmos4 1616 256 M0
WINDOW 3 56 60 Left 2
SYMATTR Value nch
SYMATTR InstName M38
SYMATTR Value2 l=130n w=0.26u
SYMBOL nmos4 1792 80 R0
WINDOW 3 56 60 Left 2
SYMATTR Value nch
SYMATTR InstName M39
SYMATTR Value2 l=130n w=130n
SYMBOL pmos4 1792 -80 R0
WINDOW 3 56 60 Left 2
SYMATTR Value pch
SYMATTR InstName M40
SYMATTR Value2 l=130n w=0.26u
SYMBOL pmos4 2192 -432 R0
WINDOW 3 56 60 Left 2
SYMATTR Value pch
SYMATTR InstName M41
SYMATTR Value2 l=130n w=1.08u
SYMBOL pmos4 2368 -432 R0
WINDOW 3 56 60 Left 2
SYMATTR Value pch
SYMATTR InstName M42
SYMATTR Value2 l=130n w=1.08u
SYMBOL pmos4 2608 -432 M0
WINDOW 3 56 60 Left 2
SYMATTR Value pch
SYMATTR InstName M43
SYMATTR Value2 l=130n w=1.08u
SYMBOL pmos4 2608 -208 M0
WINDOW 3 56 60 Left 2
SYMATTR Value pch
SYMATTR InstName M44
SYMATTR Value2 l=130n w=1.08u
SYMBOL pmos4 2608 -48 M0
WINDOW 3 56 60 Left 2
SYMATTR Value pch
SYMATTR InstName M45
SYMATTR Value2 l=130n w=1.08u
SYMBOL pmos4 2608 80 M0
WINDOW 3 56 60 Left 2
SYMATTR Value pch
SYMATTR InstName M46
SYMATTR Value2 l=130n w=1.08u
SYMBOL pmos4 2192 80 R0
WINDOW 3 56 60 Left 2
SYMATTR Value pch
SYMATTR InstName M47
SYMATTR Value2 l=130n w=0.52u
SYMBOL nmos4 2192 320 R0
WINDOW 3 56 60 Left 2
SYMATTR Value nch
SYMATTR InstName M48
SYMATTR Value2 l=130n w=0.26u
SYMBOL nmos4 2608 320 M0
WINDOW 3 56 60 Left 2
SYMATTR Value nch
SYMATTR InstName M49
SYMATTR Value2 l=130n w=0.39u
SYMBOL nmos4 2608 448 M0
WINDOW 3 56 60 Left 2
SYMATTR Value nch
SYMATTR InstName M50
SYMATTR Value2 l=130n w=0.39u
SYMBOL nmos4 2608 576 M0
WINDOW 3 56 60 Left 2
SYMATTR Value nch
SYMATTR InstName M51
SYMATTR Value2 l=130n w=0.39u
SYMBOL nmos4 2384 576 M0
WINDOW 3 56 60 Left 2
SYMATTR Value nch
SYMATTR InstName M52
SYMATTR Value2 l=130n w=0.26u
SYMBOL nmos4 2208 576 R0
WINDOW 3 56 60 Left 2
SYMATTR Value nch
SYMATTR InstName M53
SYMATTR Value2 l=130n w=0.26u
SYMBOL nmos4 2080 576 R0
WINDOW 3 56 60 Left 2
SYMATTR Value nch
SYMATTR InstName M54
SYMATTR Value2 l=130n w=0.26u
SYMBOL nmos4 2784 320 R0
WINDOW 3 56 60 Left 2
SYMATTR Value nch
SYMATTR InstName M55
SYMATTR Value2 l=130n w=130n
SYMBOL pmos4 2784 160 R0
WINDOW 3 56 60 Left 2
SYMATTR Value pch
SYMATTR InstName M56
SYMATTR Value2 l=130n w=0.26u
SYMBOL voltage 2912 -528 R0
WINDOW 123 0 0 Left 0
WINDOW 39 0 0 Left 0
SYMATTR InstName A2
SYMATTR Value PULSE(0 1.3 0 10p 10p 5n 10n)
SYMBOL voltage 2912 -304 R0
WINDOW 123 0 0 Left 0
WINDOW 39 0 0 Left 0
SYMATTR InstName B2
SYMATTR Value PULSE(0 1.3 0 10p 10p 10n 20n)
SYMBOL pmos4 3440 -384 R0
WINDOW 3 56 60 Left 2
SYMATTR Value pch
SYMATTR InstName M57
SYMATTR Value2 l=130n w=0.78u
SYMBOL pmos4 3696 -384 M0
WINDOW 3 56 60 Left 2
SYMATTR Value pch
SYMATTR InstName M58
SYMATTR Value2 l=130n w=0.78u
SYMBOL pmos4 3440 -192 R0
WINDOW 3 56 60 Left 2
SYMATTR Value pch
SYMATTR InstName M59
SYMATTR Value2 l=130n w=0.78u
SYMBOL pmos4 3440 -64 R0
WINDOW 3 56 60 Left 2
SYMATTR Value pch
SYMATTR InstName M60
SYMATTR Value2 l=130n w=0.78u
SYMBOL pmos4 3696 -128 M0
WINDOW 3 56 60 Left 2
SYMATTR Value pch
SYMATTR InstName M61
SYMATTR Value2 l=130n w=0.39u
SYMBOL nmos4 3440 112 R0
WINDOW 3 56 60 Left 2
SYMATTR Value nch
SYMATTR InstName M62
SYMATTR Value2 l=130n w=0.26u
SYMBOL nmos4 3440 256 R0
WINDOW 3 56 60 Left 2
SYMATTR Value nch
SYMATTR InstName M63
SYMATTR Value2 l=130n w=0.26u
SYMBOL nmos4 3600 112 R0
WINDOW 3 56 60 Left 2
SYMATTR Value nch
SYMATTR InstName M64
SYMATTR Value2 l=130n w=0.26u
SYMBOL nmos4 3808 112 M0
WINDOW 3 56 60 Left 2
SYMATTR Value nch
SYMATTR InstName M65
SYMATTR Value2 l=130n w=0.26u
SYMBOL nmos4 3760 256 M0
WINDOW 3 56 60 Left 2
SYMATTR Value nch
SYMATTR InstName M66
SYMATTR Value2 l=130n w=0.26u
SYMBOL nmos4 3936 80 R0
WINDOW 3 56 60 Left 2
SYMATTR Value nch
SYMATTR InstName M67
SYMATTR Value2 l=130n w=130n
SYMBOL pmos4 3936 -80 R0
WINDOW 3 56 60 Left 2
SYMATTR Value pch
SYMATTR InstName M68
SYMATTR Value2 l=130n w=0.26u
SYMBOL pmos4 4336 -432 R0
WINDOW 3 56 60 Left 2
SYMATTR Value pch
SYMATTR InstName M69
SYMATTR Value2 l=130n w=1.08u
SYMBOL pmos4 4512 -432 R0
WINDOW 3 56 60 Left 2
SYMATTR Value pch
SYMATTR InstName M70
SYMATTR Value2 l=130n w=1.08u
SYMBOL pmos4 4752 -432 M0
WINDOW 3 56 60 Left 2
SYMATTR Value pch
SYMATTR InstName M71
SYMATTR Value2 l=130n w=1.08u
SYMBOL pmos4 4752 -208 M0
WINDOW 3 56 60 Left 2
SYMATTR Value pch
SYMATTR InstName M72
SYMATTR Value2 l=130n w=1.08u
SYMBOL pmos4 4752 -48 M0
WINDOW 3 56 60 Left 2
SYMATTR Value pch
SYMATTR InstName M73
SYMATTR Value2 l=130n w=1.08u
SYMBOL pmos4 4752 80 M0
WINDOW 3 56 60 Left 2
SYMATTR Value pch
SYMATTR InstName M74
SYMATTR Value2 l=130n w=1.08u
SYMBOL pmos4 4336 80 R0
WINDOW 3 56 60 Left 2
SYMATTR Value pch
SYMATTR InstName M75
SYMATTR Value2 l=130n w=0.52u
SYMBOL nmos4 4336 320 R0
WINDOW 3 56 60 Left 2
SYMATTR Value nch
SYMATTR InstName M76
SYMATTR Value2 l=130n w=0.26u
SYMBOL nmos4 4752 320 M0
WINDOW 3 56 60 Left 2
SYMATTR Value nch
SYMATTR InstName M77
SYMATTR Value2 l=130n w=0.39u
SYMBOL nmos4 4752 448 M0
WINDOW 3 56 60 Left 2
SYMATTR Value nch
SYMATTR InstName M78
SYMATTR Value2 l=130n w=0.39u
SYMBOL nmos4 4752 576 M0
WINDOW 3 56 60 Left 2
SYMATTR Value nch
SYMATTR InstName M79
SYMATTR Value2 l=130n w=0.39u
SYMBOL nmos4 4528 576 M0
WINDOW 3 56 60 Left 2
SYMATTR Value nch
SYMATTR InstName M80
SYMATTR Value2 l=130n w=0.26u
SYMBOL nmos4 4352 576 R0
WINDOW 3 56 60 Left 2
SYMATTR Value nch
SYMATTR InstName M81
SYMATTR Value2 l=130n w=0.26u
SYMBOL nmos4 4224 576 R0
WINDOW 3 56 60 Left 2
SYMATTR Value nch
SYMATTR InstName M82
SYMATTR Value2 l=130n w=0.26u
SYMBOL nmos4 4928 320 R0
WINDOW 3 56 60 Left 2
SYMATTR Value nch
SYMATTR InstName M83
SYMATTR Value2 l=130n w=130n
SYMBOL pmos4 4928 160 R0
WINDOW 3 56 60 Left 2
SYMATTR Value pch
SYMATTR InstName M84
SYMATTR Value2 l=130n w=0.26u
SYMBOL voltage 5088 -528 R0
WINDOW 123 0 0 Left 0
WINDOW 39 0 0 Left 0
SYMATTR InstName A3
SYMATTR Value PULSE(1.3 0 0 10p 10p 10n 20n)
SYMBOL voltage 5088 -240 R0
WINDOW 123 0 0 Left 0
WINDOW 39 0 0 Left 0
SYMATTR InstName B3
SYMATTR Value PULSE(1.3 0 0 10p 10p 5n 10n)
SYMBOL pmos4 5728 -384 R0
WINDOW 3 56 60 Left 2
SYMATTR Value pch
SYMATTR InstName M85
SYMATTR Value2 l=130n w=0.78u
SYMBOL pmos4 5984 -384 M0
WINDOW 3 56 60 Left 2
SYMATTR Value pch
SYMATTR InstName M86
SYMATTR Value2 l=130n w=0.78u
SYMBOL pmos4 5728 -192 R0
WINDOW 3 56 60 Left 2
SYMATTR Value pch
SYMATTR InstName M87
SYMATTR Value2 l=130n w=0.78u
SYMBOL pmos4 5728 -64 R0
WINDOW 3 56 60 Left 2
SYMATTR Value pch
SYMATTR InstName M88
SYMATTR Value2 l=130n w=0.78u
SYMBOL pmos4 5984 -128 M0
WINDOW 3 56 60 Left 2
SYMATTR Value pch
SYMATTR InstName M89
SYMATTR Value2 l=130n w=0.39u
SYMBOL nmos4 5728 112 R0
WINDOW 3 56 60 Left 2
SYMATTR Value nch
SYMATTR InstName M90
SYMATTR Value2 l=130n w=0.26u
SYMBOL nmos4 5728 256 R0
WINDOW 3 56 60 Left 2
SYMATTR Value nch
SYMATTR InstName M91
SYMATTR Value2 l=130n w=0.26u
SYMBOL nmos4 5888 112 R0
WINDOW 3 56 60 Left 2
SYMATTR Value nch
SYMATTR InstName M92
SYMATTR Value2 l=130n w=0.26u
SYMBOL nmos4 6096 112 M0
WINDOW 3 56 60 Left 2
SYMATTR Value nch
SYMATTR InstName M93
SYMATTR Value2 l=130n w=0.26u
SYMBOL nmos4 6048 256 M0
WINDOW 3 56 60 Left 2
SYMATTR Value nch
SYMATTR InstName M94
SYMATTR Value2 l=130n w=0.26u
SYMBOL nmos4 6224 80 R0
WINDOW 3 56 60 Left 2
SYMATTR Value nch
SYMATTR InstName M95
SYMATTR Value2 l=130n w=130n
SYMBOL pmos4 6224 -80 R0
WINDOW 3 56 60 Left 2
SYMATTR Value pch
SYMATTR InstName M96
SYMATTR Value2 l=130n w=0.26u
SYMBOL pmos4 6624 -432 R0
WINDOW 3 56 60 Left 2
SYMATTR Value pch
SYMATTR InstName M97
SYMATTR Value2 l=130n w=1.08u
SYMBOL pmos4 6800 -432 R0
WINDOW 3 56 60 Left 2
SYMATTR Value pch
SYMATTR InstName M98
SYMATTR Value2 l=130n w=1.08u
SYMBOL pmos4 7040 -432 M0
WINDOW 3 56 60 Left 2
SYMATTR Value pch
SYMATTR InstName M99
SYMATTR Value2 l=130n w=1.08u
SYMBOL pmos4 7040 -208 M0
WINDOW 3 56 60 Left 2
SYMATTR Value pch
SYMATTR InstName M100
SYMATTR Value2 l=130n w=1.08u
SYMBOL pmos4 7040 -48 M0
WINDOW 3 56 60 Left 2
SYMATTR Value pch
SYMATTR InstName M101
SYMATTR Value2 l=130n w=1.08u
SYMBOL pmos4 7040 80 M0
WINDOW 3 56 60 Left 2
SYMATTR Value pch
SYMATTR InstName M102
SYMATTR Value2 l=130n w=1.08u
SYMBOL pmos4 6624 80 R0
WINDOW 3 56 60 Left 2
SYMATTR Value pch
SYMATTR InstName M103
SYMATTR Value2 l=130n w=0.52u
SYMBOL nmos4 6624 320 R0
WINDOW 3 56 60 Left 2
SYMATTR Value nch
SYMATTR InstName M104
SYMATTR Value2 l=130n w=0.26u
SYMBOL nmos4 7040 320 M0
WINDOW 3 56 60 Left 2
SYMATTR Value nch
SYMATTR InstName M105
SYMATTR Value2 l=130n w=0.39u
SYMBOL nmos4 7040 448 M0
WINDOW 3 56 60 Left 2
SYMATTR Value nch
SYMATTR InstName M106
SYMATTR Value2 l=130n w=0.39u
SYMBOL nmos4 7040 576 M0
WINDOW 3 56 60 Left 2
SYMATTR Value nch
SYMATTR InstName M107
SYMATTR Value2 l=130n w=0.39u
SYMBOL nmos4 6816 576 M0
WINDOW 3 56 60 Left 2
SYMATTR Value nch
SYMATTR InstName M108
SYMATTR Value2 l=130n w=0.26u
SYMBOL nmos4 6640 576 R0
WINDOW 3 56 60 Left 2
SYMATTR Value nch
SYMATTR InstName M109
SYMATTR Value2 l=130n w=0.26u
SYMBOL nmos4 6512 576 R0
WINDOW 3 56 60 Left 2
SYMATTR Value nch
SYMATTR InstName M110
SYMATTR Value2 l=130n w=0.26u
SYMBOL nmos4 7216 320 R0
WINDOW 3 56 60 Left 2
SYMATTR Value nch
SYMATTR InstName M111
SYMATTR Value2 l=130n w=130n
SYMBOL pmos4 7216 160 R0
WINDOW 3 56 60 Left 2
SYMATTR Value pch
SYMATTR InstName M112
SYMATTR Value2 l=130n w=0.26u
SYMBOL voltage 7376 -528 R0
WINDOW 123 0 0 Left 0
WINDOW 39 0 0 Left 0
SYMATTR InstName A4
SYMATTR Value PULSE(0 1.3 0 10p 10p 10n 20n)
SYMBOL voltage 7376 -240 R0
WINDOW 123 0 0 Left 0
WINDOW 39 0 0 Left 0
SYMATTR InstName B4
SYMATTR Value PULSE(0 1.3 0 10p 10p 5n 10n)
TEXT -824 912 Left 2 !.lib "C:\\Users\\Admin\\OneDrive - VNU-HCMUS\\HK6-23.24\\MACH-TICH-HOP-VA-CONG-NGHE\\doan\\130nm_bulk.lib"
TEXT -288 -824 Left 6 ;FA-1
TEXT 2048 -800 Left 6 ;FA-2
TEXT 4248 -800 Left 6 ;FA-3
TEXT 6520 -792 Left 6 ;FA-4
TEXT -768 -720 Left 2 !.tran 40n

The netlist it stands for:
* Full_adder_4bit.asc
M1 VDD A1 N005 VDD pch l=130n w=0.78u
M2 VDD B1 N005 VDD pch l=130n w=0.78u
M3 N005 A1 N009 VDD pch l=130n w=0.78u
M4 N009 B1 CO_BAR1 VDD pch l=130n w=0.78u
M5 N005 C1 CO_BAR1 VDD pch l=130n w=0.39u
M6 CO_BAR1 A1 N029 0 nch l=130n w=0.26u
M7 N029 B1 0 0 nch l=130n w=0.26u
M8 CO_BAR1 A1 N021 0 nch l=130n w=0.26u
M9 CO_BAR1 B1 N021 0 nch l=130n w=0.26u
M10 N021 C1 0 0 nch l=130n w=0.26u
M11 C2 CO_BAR1 0 0 nch l=130n w=130n
M12 VDD CO_BAR1 C2 VDD pch l=130n w=0.26u
M13 VDD A1 N001 VDD pch l=130n w=1.08u
M14 VDD B1 N001 VDD pch l=130n w=1.08u
M15 VDD C1 N001 VDD pch l=130n w=1.08u
M16 N001 A1 N013 VDD pch l=130n w=1.08u
M17 N013 B1 N017 VDD pch l=130n w=1.08u
M18 N017 C1 N022 VDD pch l=130n w=1.08u
M19 N001 CO_BAR1 N022 VDD pch l=130n w=0.52u
M20 N022 CO_BAR1 N037 0 nch l=130n w=0.26u
M21 N022 A1 N033 0 nch l=130n w=0.39u
M22 N033 B1 N041 0 nch l=130n w=0.39u
M23 N041 C1 0 0 nch l=130n w=0.39u
M24 N037 C1 0 0 nch l=130n w=0.26u
M25 N037 B1 0 0 nch l=130n w=0.26u
M26 N037 A1 0 0 nch l=130n w=0.26u
M27 S1 N022 0 0 nch l=130n w=130n
M28 VDD N022 S1 VDD pch l=130n w=0.26u
V§A1 A1 0 PULSE(1.3 0 0 10p 10p 5n 10n)
V§B1 B1 0 PULSE(1.3 0 0 10p 10p 10n 20n)
V§C1 C1 0 0
VDD VDD 0 1.3
M29 VDD A2 N006 VDD pch l=130n w=0.78u
M30 VDD B2 N006 VDD pch l=130n w=0.78u
M31 N006 A2 N010 VDD pch l=130n w=0.78u
M32 N010 B2 CO_BAR2 VDD pch l=130n w=0.78u
M33 N006 C2 CO_BAR2 VDD pch l=130n w=0.39u
M34 CO_BAR2 A2 N030 0 nch l=130n w=0.26u
M35 N030 B2 0 0 nch l=130n w=0.26u
M36 CO_BAR2 A2 N023 0 nch l=130n w=0.26u
M37 CO_BAR2 B2 N023 0 nch l=130n w=0.26u
M38 N023 C2 0 0 nch l=130n w=0.26u
M39 C3 CO_BAR2 0 0 nch l=130n w=130n
M40 VDD CO_BAR2 C3 VDD pch l=130n w=0.26u
M41 VDD A2 N002 VDD pch l=130n w=1.08u
M42 VDD B2 N002 VDD pch l=130n w=1.08u
M43 VDD C2 N002 VDD pch l=130n w=1.08u
M44 N002 A2 N014 VDD pch l=130n w=1.08u
M45 N014 B2 N018 VDD pch l=130n w=1.08u
M46 N018 C2 N024 VDD pch l=130n w=1.08u
M47 N002 CO_BAR2 N024 VDD pch l=130n w=0.52u
M48 N024 CO_BAR2 N038 0 nch l=130n w=0.26u
M49 N024 A2 N034 0 nch l=130n w=0.39u
M50 N034 B2 N042 0 nch l=130n w=0.39u
M51 N042 C2 0 0 nch l=130n w=0.39u
M52 N038 C2 0 0 nch l=130n w=0.26u
M53 N038 B2 0 0 nch l=130n w=0.26u
M54 N038 A2 0 0 nch l=130n w=0.26u
M55 S2 N024 0 0 nch l=130n w=130n
M56 VDD N024 S2 VDD pch l=130n w=0.26u
V§A2 A2 0 PULSE(0 1.3 0 10p 10p 5n 10n)
V§B2 B2 0 PULSE(0 1.3 0 10p 10p 10n 20n)
M57 VDD A3 N007 VDD pch l=130n w=0.78u
M58 VDD B3 N007 VDD pch l=130n w=0.78u
M59 N007 A3 N011 VDD pch l=130n w=0.78u
M60 N011 B3 CO_BAR3 VDD pch l=130n w=0.78u
M61 N007 C3 CO_BAR3 VDD pch l=130n w=0.39u
M62 CO_BAR3 A3 N031 0 nch l=130n w=0.26u
M63 N031 B3 0 0 nch l=130n w=0.26u
M64 CO_BAR3 A3 N025 0 nch l=130n w=0.26u
M65 CO_BAR3 B3 N025 0 nch l=130n w=0.26u
M66 N025 C3 0 0 nch l=130n w=0.26u
M67 C4 CO_BAR3 0 0 nch l=130n w=130n
M68 VDD CO_BAR3 C4 VDD pch l=130n w=0.26u
M69 VDD A3 N003 VDD pch l=130n w=1.08u
M70 VDD B3 N003 VDD pch l=130n w=1.08u
M71 VDD C3 N003 VDD pch l=130n w=1.08u
M72 N003 A3 N015 VDD pch l=130n w=1.08u
M73 N015 B3 N019 VDD pch l=130n w=1.08u
M74 N019 C3 N026 VDD pch l=130n w=1.08u
M75 N003 CO_BAR3 N026 VDD pch l=130n w=0.52u
M76 N026 CO_BAR3 N039 0 nch l=130n w=0.26u
M77 N026 A3 N035 0 nch l=130n w=0.39u
M78 N035 B3 N043 0 nch l=130n w=0.39u
M79 N043 C3 0 0 nch l=130n w=0.39u
M80 N039 C3 0 0 nch l=130n w=0.26u
M81 N039 B3 0 0 nch l=130n w=0.26u
M82 N039 A3 0 0 nch l=130n w=0.26u
M83 S3 N026 0 0 nch l=130n w=130n
M84 VDD N026 S3 VDD pch l=130n w=0.26u
V§A3 A3 0 PULSE(1.3 0 0 10p 10p 10n 20n)
V§B3 B3 0 PULSE(1.3 0 0 10p 10p 5n 10n)
M85 VDD A4 N008 VDD pch l=130n w=0.78u
M86 VDD B4 N008 VDD pch l=130n w=0.78u
M87 N008 A4 N012 VDD pch l=130n w=0.78u
M88 N012 B4 CO_BAR4 VDD pch l=130n w=0.78u
M89 N008 C4 CO_BAR4 VDD pch l=130n w=0.39u
M90 CO_BAR4 A4 N032 0 nch l=130n w=0.26u
M91 N032 B4 0 0 nch l=130n w=0.26u
M92 CO_BAR4 A4 N027 0 nch l=130n w=0.26u
M93 CO_BAR4 B4 N027 0 nch l=130n w=0.26u
M94 N027 C4 0 0 nch l=130n w=0.26u
M95 CO4 CO_BAR4 0 0 nch l=130n w=130n
M96 VDD CO_BAR4 CO4 VDD pch l=130n w=0.26u
M97 VDD A4 N004 VDD pch l=130n w=1.08u
M98 VDD B4 N004 VDD pch l=130n w=1.08u
M99 VDD C4 N004 VDD pch l=130n w=1.08u
M100 N004 A4 N016 VDD pch l=130n w=1.08u
M101 N016 B4 N020 VDD pch l=130n w=1.08u
M102 N020 C4 N028 VDD pch l=130n w=1.08u
M103 N004 CO_BAR4 N028 VDD pch l=130n w=0.52u
M104 N028 CO_BAR4 N040 0 nch l=130n w=0.26u
M105 N028 A4 N036 0 nch l=130n w=0.39u
M106 N036 B4 N044 0 nch l=130n w=0.39u
M107 N044 C4 0 0 nch l=130n w=0.39u
M108 N040 C4 0 0 nch l=130n w=0.26u
M109 N040 B4 0 0 nch l=130n w=0.26u
M110 N040 A4 0 0 nch l=130n w=0.26u
M111 S4 N028 0 0 nch l=130n w=130n
M112 VDD N028 S4 VDD pch l=130n w=0.26u
V§A4 A4 0 PULSE(0 1.3 0 10p 10p 10n 20n)
V§B4 B4 0 PULSE(0 1.3 0 10p 10p 5n 10n)
.model NMOS NMOS
.model PMOS PMOS
.lib standard.mos
.lib "C:\Users\Admin\OneDrive - VNU-HCMUS\HK6-23.24\MACH-TICH-HOP-VA-CONG-NGHE\doan\130nm_bulk.lib"
* FA-1
* FA-2
* FA-3
* FA-4
.tran 40n
.backanno
.end